# EAGLE design Power_Distro_PCB (EAGLE 8.3.2)
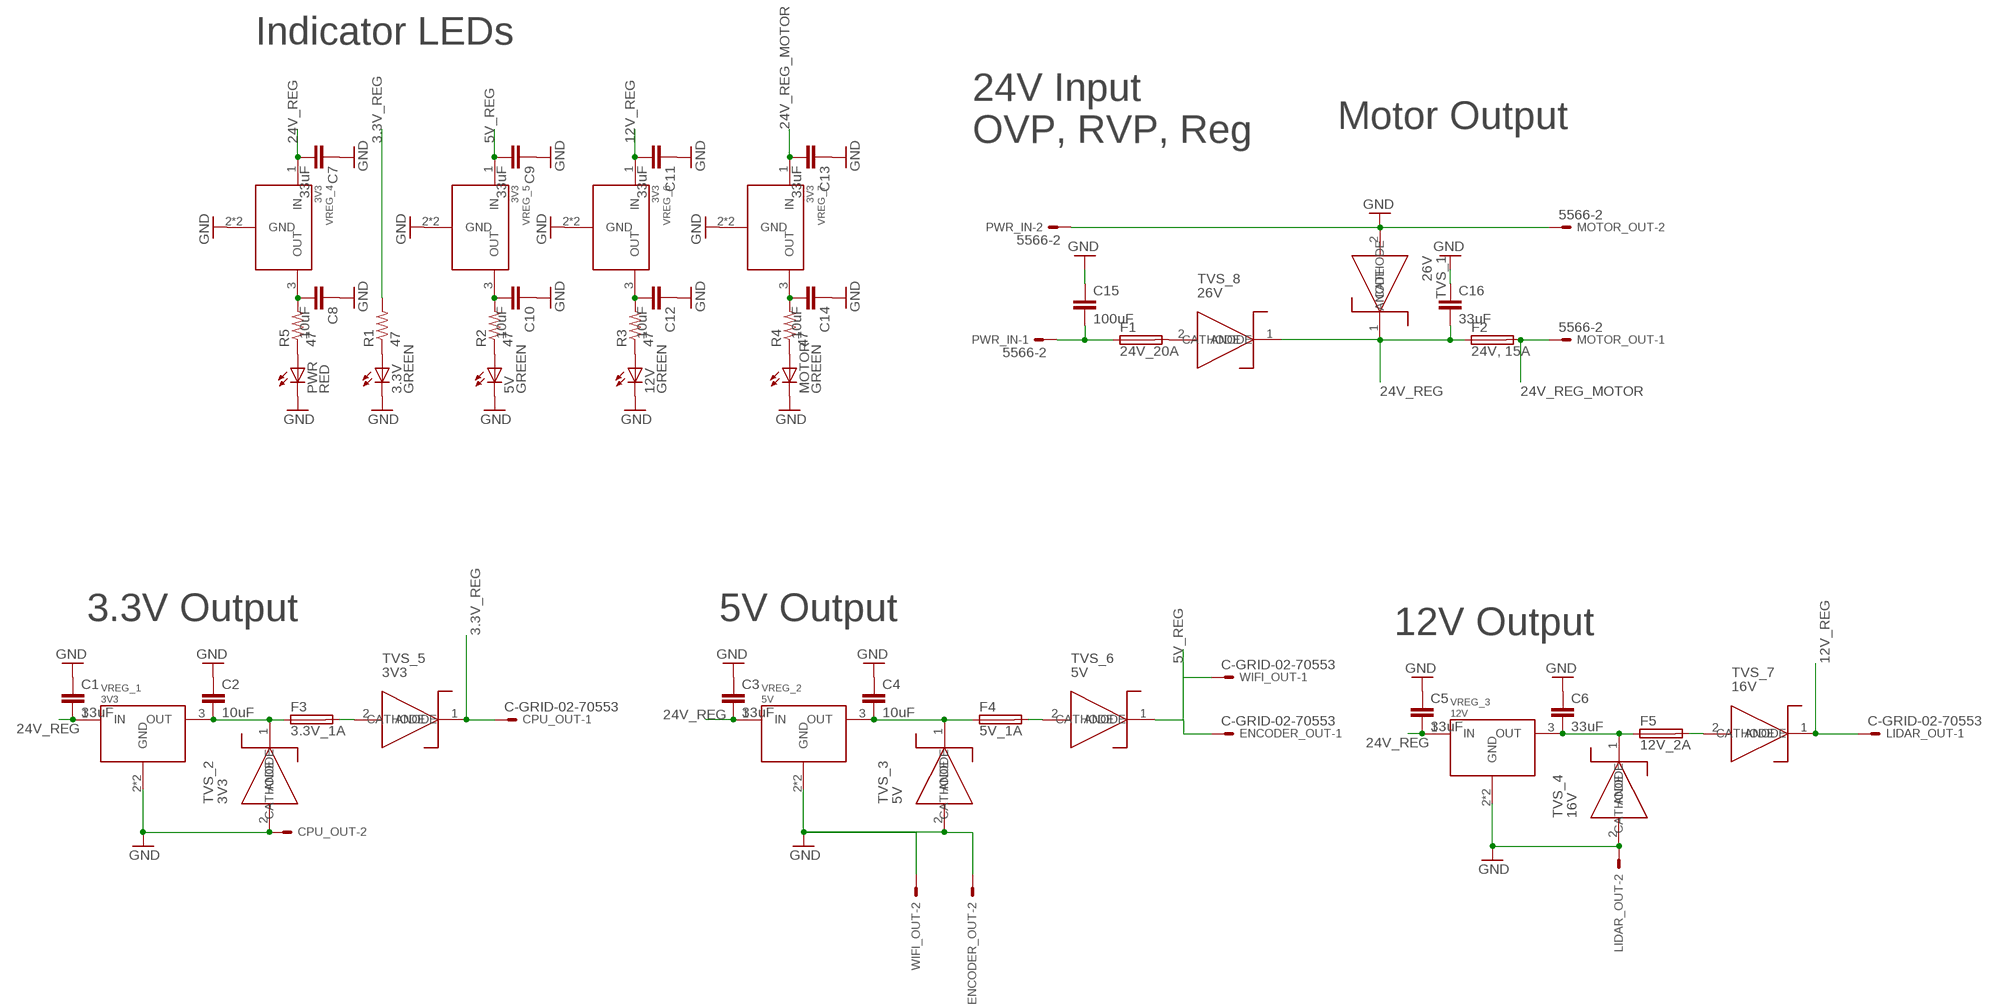
[diagram p0: schematic, sheet 1]

## Parts
3.3V  GREEN  LEDSML1206  [SML1206]
5V  GREEN  LEDSML1206  [SML1206]
12V  GREEN  LEDSML1206  [SML1206]
C1  33uF  C-EUC1206  [C1206]
C2  10uF  C-EUC1206  [C1206]
C3  33uF  C-EUC1206  [C1206]
C4  10uF  C-EUC1206  [C1206]
C5  33uF  C-EUC1206  [C1206]
C6  33uF  C-EUC1206  [C1206]
C7  33uF  C-EUC1206  [C1206]
C8  10uF  C-EUC1206  [C1206]
C9  33uF  C-EUC1206  [C1206]
C10  10uF  C-EUC1206  [C1206]
C11  33uF  C-EUC1206  [C1206]
C12  10uF  C-EUC1206  [C1206]
C13  33uF  C-EUC1206  [C1206]
C14  10uF  C-EUC1206  [C1206]
C15  100uF  C-EUC1206  [C1206]
C16  33uF  C-EUC1206  [C1206]
CPU_OUT  C-GRID-02-70553  [70553-02]
ENCODER_OUT  C-GRID-02-70553  [70553-02]
F1  24V_20A  TE5  [TE5]
F2  24V, 15A  TE5  [TE5]
F3  3.3V_1A  TE5  [TE5]
F4  5V_1A  TE5  [TE5]
F5  12V_2A  TE5  [TE5]
LIDAR_OUT  C-GRID-02-70553  [70553-02]
MOTOR  GREEN  LEDSML1206  [SML1206]
MOTOR_OUT  5566-2  [5566-2]
PWR  RED  LEDSML1206  [SML1206]
PWR_IN  5566-2  [5566-2]
R1  47  R-US_R1206  [R1206]
R2  47  R-US_R1206  [R1206]
R3  47  R-US_R1206  [R1206]
R4  47  R-US_R1206  [R1206]
R5  47  R-US_R1206  [R1206]
TVS_1  26V  SMAJ26A_TVSSMA  [DO-214AC]
TVS_2  3V3  SMBJ3V3_TVSSMB  [DO-214AA]
TVS_3  5V  SMAJ5.0_TVSSMA  [DO-214AC]
TVS_4  16V  PRSMA16_TVS  [DO-214AC]
TVS_5  3V3  SMBJ3V3_TVSSMB  [DO-214AA]
TVS_6  5V  SMAJ5.0_TVSSMA  [DO-214AC]
TVS_7  16V  PRSMA16_TVS  [DO-214AC]
TVS_8  26V  SMAJ26A_TVSSMA  [DO-214AC]
VREG_1  3V3  HIGH-CURRENT_REGSMA  [TO-263-3]
VREG_2  5V  HIGH-CURRENT_REGSMA  [TO-263-3]
VREG_3  12V  HIGH-CURRENT_REGSMA  [TO-263-3]
VREG_4  3V3  HIGH-CURRENT_REGSMA  [TO-263-3]
VREG_5  3V3  HIGH-CURRENT_REGSMA  [TO-263-3]
VREG_6  3V3  HIGH-CURRENT_REGSMA  [TO-263-3]
VREG_7  3V3  HIGH-CURRENT_REGSMA  [TO-263-3]
WIFI_OUT  C-GRID-02-70553  [70553-02]

## Nets
3.3V_REG: CPU_OUT.1 R1.2 TVS_5.1(CATHODE)
5V_REG: C9.2 ENCODER_OUT.1 TVS_6.1(CATHODE) VREG_5.1(IN) WIFI_OUT.1
12V_REG: C11.2 LIDAR_OUT.1 TVS_7.1(CATHODE) VREG_6.1(IN)
24V_REG: C1.2 C3.2 C5.2 C7.2 C16.2 F2.1 TVS_1.1(CATHODE) TVS_8.1(CATHODE) VREG_1.1(IN) VREG_2.1(IN) VREG_3.1(IN) VREG_4.1(IN)
24V_REG_MOTOR: C13.2 F2.2 MOTOR_OUT.1 VREG_7.1(IN)
GND: 3.3V.C 5V.C 12V.C C1.1 C2.1 C3.1 C4.1 C5.1 C6.1 C7.1 C8.1 C9.1 C10.1 C11.1 C12.1 C13.1 C14.1 C15.1 C16.1 CPU_OUT.2 ENCODER_OUT.2 LIDAR_OUT.2 MOTOR.C MOTOR_OUT.2 PWR.C PWR_IN.2 TVS_1.2(ANODE) TVS_2.2(ANODE) TVS_3.2(ANODE) TVS_4.2(ANODE) VREG_1.2(GND) VREG_1.4(GND) VREG_2.2(GND) VREG_2.4(GND) VREG_3.2(GND) VREG_3.4(GND) VREG_4.2(GND) VREG_4.4(GND) VREG_5.2(GND) VREG_5.4(GND) VREG_6.2(GND) VREG_6.4(GND) VREG_7.2(GND) VREG_7.4(GND) WIFI_OUT.2
N$1: F1.2 TVS_8.2(ANODE)
N$2: 3.3V.A R1.1
N$3: C15.2 F1.1 PWR_IN.1
N$4: F3.2 TVS_5.2(ANODE)
N$5: 5V.A R2.1
N$6: C2.2 F3.1 TVS_2.1(CATHODE) VREG_1.3(OUT)
N$7: C4.2 F4.1 TVS_3.1(CATHODE) VREG_2.3(OUT)
N$8: 12V.A R3.1
N$9: MOTOR.A R4.1
N$10: C6.2 F5.1 TVS_4.1(CATHODE) VREG_3.3(OUT)
N$11: F4.2 TVS_6.2(ANODE)
N$12: PWR.A R5.1
N$13: C8.2 R5.2 VREG_4.3(OUT)
N$14: C10.2 R2.2 VREG_5.3(OUT)
N$15: C12.2 R3.2 VREG_6.3(OUT)
N$16: C14.2 R4.2 VREG_7.3(OUT)
N$17: F5.2 TVS_7.2(ANODE)

## Notes on the sheet
- Indicator LEDs
- Motor Output
- 24V Input 
  OVP, RVP, Reg
- 3.3V Output | 5V Output
- 12V Output

## Library data of the parts
3.3V 5V 12V MOTOR PWR = led:LED: LED OSRAM: - CHIPLED LG R971, LG N971, LY N971, LG Q971, LY Q971, LO R971, LY R971 LH N974, LH R974 LS Q976, LO Q976, LY Q976 LO Q996 - Hyper CHIPLED LW Q18S LB Q993, LB Q99A, LB R99A - SideLED LS A670, LO A670, LY A670, LG A670, LP A670 LB A673, LV A673, LT A673, LW A673 LH A674 LY A675 LS A676, LA A676, LO A676, LY A676, LW A676 LS A679, LY A679, LG A679 - Hyper Micro SIDELED® LS Y876, LA Y876, LO Y876, LY Y876 LT Y87S - SmartLED LW L88C, LW L88S LB L89C, LB L89S, LG L890 LS L89K, LO L89K, LY L89K LS L896, LA L896, LO L896, LY L896 - TOPLED LS T670, LO T670, LY T670, LG T670, LP T670 LSG T670, LSP T670, LSY T670, LOP T670, LYG T670 LG T671, LOG T671, LSG T671 LB T673, LV T673, LT T673, LW T673 LH T674 LS T676, LA T676, LO T676, LY T676, LB T676, LH T676, LSB T676, LW T676 LB T67C, LV T67C, LT T67C, LS T67K, LO T67K, LY T67K, LW E67C LS E67B, LA E67B, LO E67B, LY E67B, LB E67C, LV E67C, LT E67C LW T67C LS T679, LY T679, LG T679 LS T770, LO T770, LY T770, LG T770, LP T770 LB T773, LV T773, LT T773, LW T773 LH T774 LS E675, LA E675, LY E675, LS T675 LS T776, LA T776, LO T776, LY T776, LB T776 LHGB T686 LT T68C, LB T68C - Hyper Mini TOPLED® LB M676 - Mini TOPLED Santana® LG M470 LS M47K, LO M47K, LY M47K Source: http://www.osram.convergy.de LUXEON: - LUMILED® LXK2-PW12-R00, LXK2-PW12-S00, LXK2-PW14-U00, LXK2-PW14-V00 LXK2-PM12-R00, LXK2-PM12-S00, LXK2-PM14-U00 LXK2-PE12-Q00, LXK2-PE12-R00, LXK2-PE12-S00, LXK2-PE14-T00, LXK2-PE14-U00 LXK2-PB12-K00, LXK2-PB12-L00, LXK2-PB12-M00, LXK2-PB14-N00, LXK2-PB14-P00, LXK2-PB14-Q00 LXK2-PR12-L00, LXK2-PR12-M00, LXK2-PR14-Q00, LXK2-PR14-R00 LXK2-PD12-Q00, LXK2-PD12-R00, LXK2-PD12-S00 LXK2-PH12-R00, LXK2-PH12-S00 LXK2-PL12-P00, LXK2-PL12-Q00, LXK2-PL12-R00 Source: www.luxeon.com KINGBRIGHT: KA-3528ASYC Source: www.kingbright.com
C1-C16 = resistor:C-EU: CAPACITOR, European symbol
CPU_OUT ENCODER_OUT LIDAR_OUT WIFI_OUT = con-molex:C-GRID-02: CONNECTOR wire to board 2.54 mm (0.100") pitch header; OC_FARNELL: unknown; OC_NEWARK: unknown
F1-F5 = fuse:TE5: FUSE Wickmann; OC_FARNELL: unknown; OC_NEWARK: unknown
MOTOR_OUT PWR_IN = con-molex:5566-2: Mini FIT connector 2 pol Source: http://www.molex.com; OC_FARNELL: 1822072; OC_NEWARK: unknown
R1-R5 = resistor:R-US_: RESISTOR, American symbol
TVS_1 TVS_8 = POWER_DISTRO:SMAJ26A_TVS: TVS Diode, SMAJ26A
TVS_2 TVS_5 = POWER_DISTRO:SMBJ3V3_TVS: SMBJ_3.3, TVS Diode
TVS_3 TVS_6 = POWER_DISTRO:SMAJ5.0_TVS: TVS Diode, SMAJ Series
TVS_4 TVS_7 = POWER_DISTRO:PRSMA16_TVS: TVS Diode, PRSMA16
VREG_1-VREG_7 = POWER_DISTRO:HIGH-CURRENT_REG: MIC29X, High Voltage Reg.

## Net classes
0 default: width 0.025 mm, drill 0.254 mm, clearance 0.254 mm
1 Power IN: width 4.801 mm
2 Motor_OUT: width 4.801 mm
3 3.3V_1A: width 0.305 mm
4 5V_1A: width 0.305 mm
5 12V_2A: width 0.813 mm

## Board
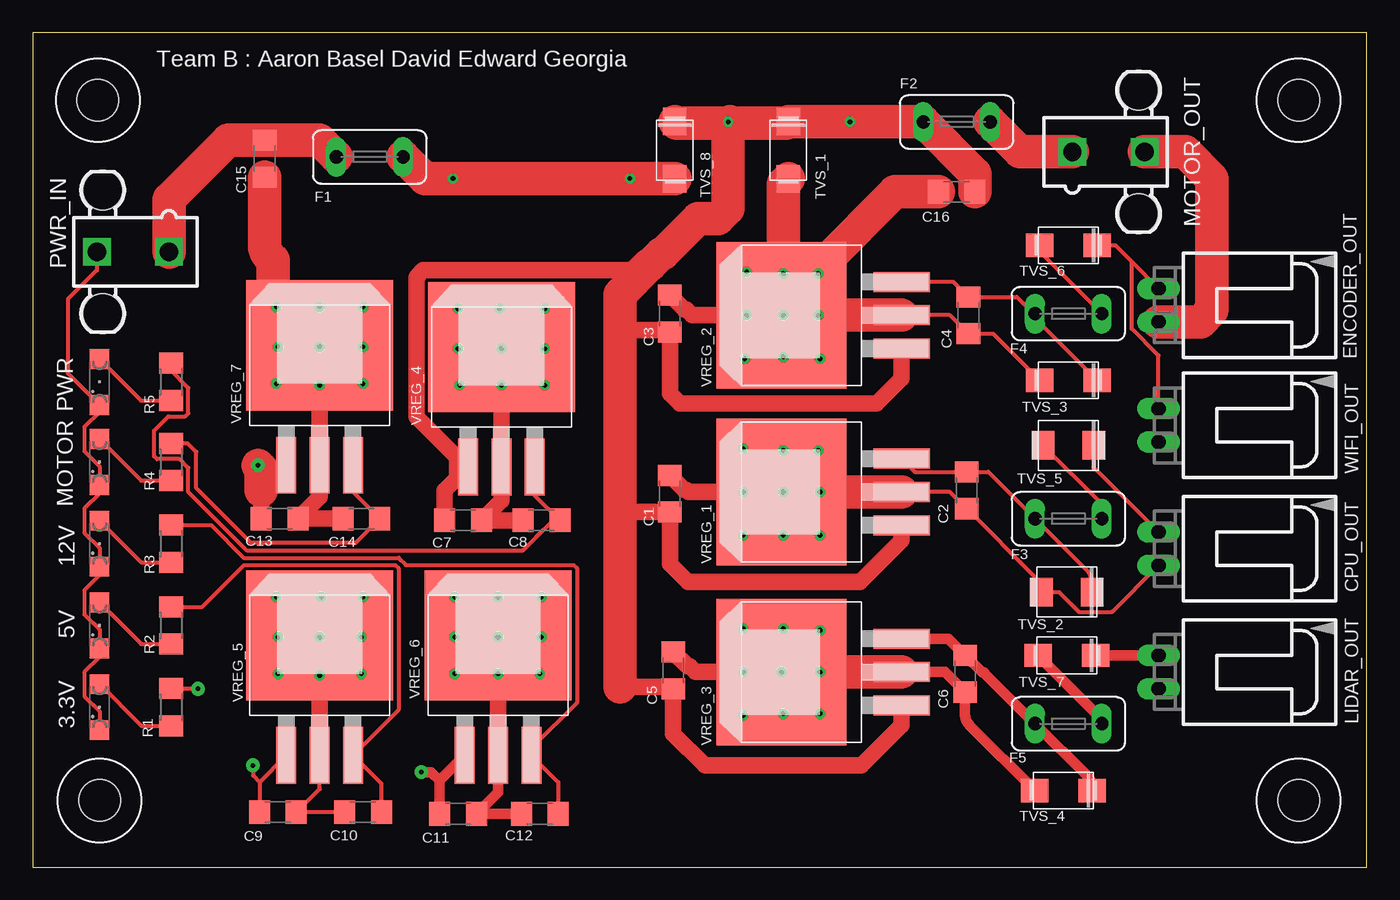
[diagram p1: board, top side]
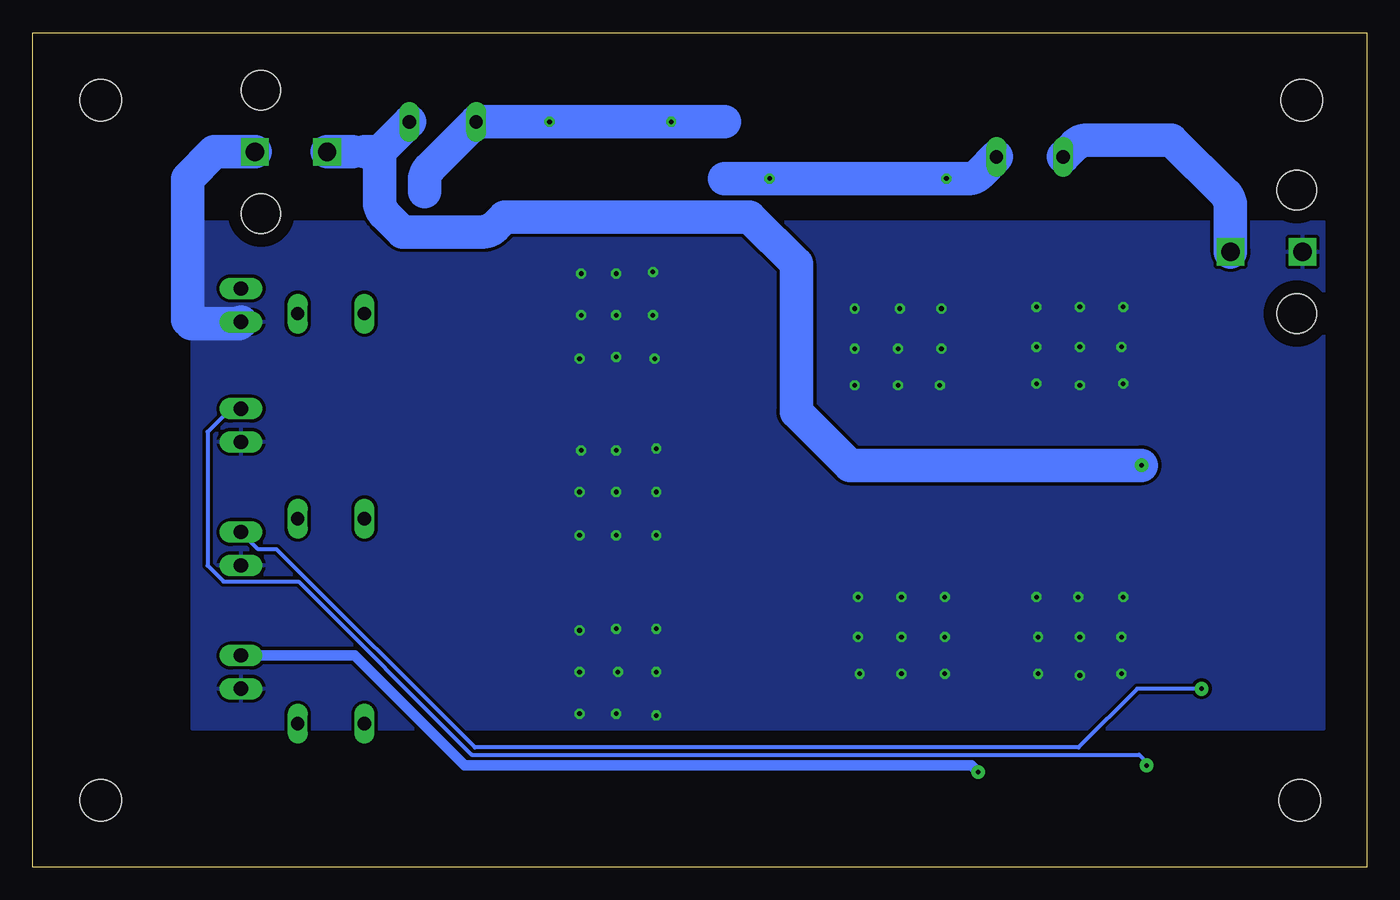
[diagram p2: board, bottom side, seen from below]

Size 101.58 x 63.55 mm. Coordinates in mm from the lower left corner, seen from the top.
Outline: 0,0 101.58,0 101.58,63.55 0,63.55 0,0
Copper layers (1*16): Top 0.035mm / dielectric 1.5mm / Bottom 0.035mm
Design rules "default *": minimum track width 6mil, minimum drill 0.35mm, track to track 6mil, track to pad 6mil, pad to pad 6mil, via to via 6mil, smd to smd 6mil, copper to edge 40mil, drill to drill 6mil, minimum pad ring 10mil, minimum via ring 8mil, stop-mask expansion 4mil, vias tented up to drill 0mil, thermal gap 10mil
Holes 3.17 mm at 5.08,5.08 96.39,5.08 4.95,58.42 96.39,58.42

### Footprints (pad centres in the part's own frame; a part is rotated, then mirrored left to right if it is on the bottom)
SML1206 = smd 1.5 x 1.5: A 1.75,0; C -1.75,0
C1206 = smd 1.6 x 1.8: 1 -1.4,0; 2 1.4,0
70553-02 = drill 1.092 long: 1 -1.27,-7.62; 2 1.27,-7.62
TE5 = drill 1.016 long: 1 -2.54,0; 2 2.54,0
5566-2 = drill 1.4 square: 1 0,-2.75; 2 0,2.75 | hole 3: 4.7,2.29; -4.7,2.29
R1206 = smd 1.6 x 1.803: 1 -1.422,0; 2 1.422,0
DO-214AC = smd 2.083 x 1.778: 1 -2.184,0; 2 2.184,0
DO-214AA = smd 1.702 x 2.184: 1 -1.93,0 | smd 1.714 x 2.184: 2 1.93,0
TO-263-3 = smd 1.524 x 4.318: 1 -2.54,-7.62; 2 0,-7.62; 3 2.54,-7.62 | smd 11.176 x 9.906: 4 0,1.524

### Placement (x,y rotation side)
3.3V  5.08,12.19 90 top
5V  5.08,18.41 90 top
12V  5.08,24.64 90 top
C1  48.51,28.45 270 top
C2  71.12,28.7 90 top
C3  48.51,42.16 270 top
C4  71.25,42.04 90 top
C5  48.77,14.99 270 top
C6  70.99,14.73 90 top
C7  32.77,26.42 180 top
C8  38.73,26.42 0 top
C9  18.67,4.19 180 top
C10  25.15,4.19 0 top
C11  32.38,4.06 180 top
C12  38.61,4.06 0 top
C13  18.8,26.54 180 top
C14  25.02,26.54 0 top
C15  17.65,53.98 90 top
C16  70.36,51.44 0 top
CPU_OUT  93.34,24.26 270 top
ENCODER_OUT  93.34,42.8 270 top
F1  25.65,54.1 0 top
F2  70.36,56.77 0 top
F3  78.87,26.54 0 top
F4  78.87,42.16 0 top
F5  78.87,10.92 0 top
LIDAR_OUT  93.34,14.86 270 top
MOTOR  5.08,30.86 90 top
MOTOR_OUT  81.92,54.48 270 top
PWR  5.08,36.96 90 top
PWR_IN  7.62,46.86 90 top
R1  10.54,12.19 90 top
R2  10.54,18.41 90 top
R3  10.54,24.64 90 top
R4  10.54,30.86 90 top
R5  10.54,36.96 90 top
TVS_1  57.53,54.61 270 top
TVS_2  78.74,20.95 180 top
TVS_3  78.87,37.08 180 top
TVS_4  78.49,5.84 180 top
TVS_5  78.87,32.13 180 top
TVS_6  78.87,47.37 180 top
TVS_7  78.74,16.13 180 top
TVS_8  48.9,54.61 270 top
VREG_1  58.55,28.57 90 top
VREG_2  58.55,42.04 90 top
VREG_3  58.55,14.86 90 top
VREG_4  35.69,38.1 0 top
VREG_5  21.84,16.13 0 top
VREG_6  35.43,16.13 0 top
VREG_7  21.84,38.23 0 top
WIFI_OUT  93.34,33.66 270 top

### Tracks (layer width: path | path; a pad name or v marks a point on that pad's centre or on a via)
3.3V_REG  (via drill 0.35 pad 1.05)
  Top 0.305: 85.34,25.53 CPU_OUT.1 80.8,30.45 TVS_5.1 | R1.2 12.55,13.61 v12.57,13.59
  Bottom 0.305: v12.57,13.59 17.48,13.59 21.95,9.12 67.92,9.12 83.01,24.21 84.41,24.21 CPU_OUT.1
5V_REG  (via drill 0.35 pad 1.05)
  Top 0.305: 17.27,6.47 C9.2 | 17.27,6.47 VREG_5.1 | v16.76,7.75 16.76,6.98 17.27,6.47 | TVS_6.1 82.42,47.37 83.68,46.11 | 83.68,46.11 ENCODER_OUT.1 | 83.68,46.11 83.68,41.02 85.72,38.98 WIFI_OUT.1
  Bottom 0.305: WIFI_OUT.1 86.49,34.92 88.27,33.15 88.27,22.98 87.05,21.76 81.35,21.76 68.15,8.56 17.32,8.56 16.76,8 v16.76,7.75
12V_REG  (via drill 0.35 pad 1.05)
  Top 0.813: 30.98,6.6 C11.2 | 30.98,6.6 VREG_6.1 | v29.59,7.24 30.35,7.24 30.98,6.6 | TVS_7.1 LIDAR_OUT.1
  Bottom 0.813: 85.2,16.13 LIDAR_OUT.1 77.09,16.13 68.71,7.75 30.1,7.75 v29.59,7.24
24V_REG  (via drill 0.35)
  Top 1.27: VREG_1.1 66.17,24.89 62.99,21.72 49.91,21.72 48.51,23.11 C1.2 44.7,27.05 44.62,27.05 | VREG_3.1 66.17,10.79 63.12,7.75 51.18,7.75 48.77,10.16 C5.2 48.64,13.72 44.7,13.72 | VREG_2.1 66.17,37.21 64.26,35.31 49.28,35.31 48.51,36.07 C3.2 48.38,40.89 44.7,40.89 | C7.2 31.37,28.7 32.32,29.65 | 32.32,29.65 VREG_4.1 | 47.03,45.89 46.61,45.47 29.73,45.47 29.21,44.95 29.21,34.3 32.32,31.19 32.32,29.65
  Top 2.54: 52.96,56.67 53.09,56.79 | 52.96,56.67 52.96,50.16 52.2,49.4 50.67,49.4 48.01,46.74 47.88,46.74 47.03,45.89 46.98,45.89 44.7,43.61 44.7,40.89 44.7,27.05 44.7,13.72 | C16.2 71.76,52.83 F2.1 65.25,56.79 TVS_1.1 57.4,56.67 52.96,56.67 | TVS_8.1 49.02,56.67 52.96,56.67
  Bottom 2.54: 57.53,56.77 v62.23,56.77 F2.1 71.38,53.2 arc-45 71.75,52.31 C16.2 | 57.53,56.77 57.4,56.77 57.53,56.77 | 57.53,56.77 v52.96,56.77 48.9,56.77
24V_REG_MOTOR  (via drill 0.35 pad 1.05)
  Top 1.27: C13.2 17.4,28.7 VREG_7.1
  Top 2.54: F2.2 75.18,54.48 MOTOR_OUT.1 | 17.4,28.7 17.4,30.36 v17.14,30.61
  Bottom 2.54: 76.33,54.48 75.18,54.48 | MOTOR_OUT.1 77.22,54.48 | v17.14,30.61 39.37,30.61 43.43,34.67 43.43,45.97 46.99,49.53 65.66,49.53 66.43,48.76 arc45 67.33,48.39 73.41,48.39 74.81,49.79 arc45 75.18,50.69 75.18,54.48 | 75.18,54.48 F2.2
GND  (via drill 0.35)
  Top 0.152: VREG_2.4 arc-45 57.29,42.69 v59.82,45.21 | VREG_2.4 57.02,42.27 arc-45 57.4,43.17 60.2,45.97 | VREG_2.4 57.02,44.91 arc-45 v57.15,45.21 | VREG_2.4 57.02,45.03 arc-45 57.15,45.34 | VREG_2.4 53.72,42.04 | 53.85,28.57 VREG_1.4 v57.15,28.57 | v35.43,17.53 VREG_6.4 35.43,14.22 | v21.84,17.53 VREG_5.4 21.84,14.35 | VREG_3.4 53.72,14.86 | VREG_7.4 arc-45 20.98,40.11 18.29,42.8
  Top 0.305: VREG_2.2 69.85,42.04 C4.1 73.13,40.64 TVS_3.2 | VREG_1.2 69.85,28.57 C2.1 76.44,21.98 arc-45 76.81,21.09 TVS_2.2 78.15,20.95 79.65,19.46 82.19,19.46 CPU_OUT.2 | VREG_5.2 21.84,5.97 C9.1 C10.1 | 3.3V.C 5.08,11.87 3.92,13.02 3.92,14.86 5.08,16.02 5V.C 5.08,18.09 3.92,19.25 3.92,21.08 5.08,22.24 12V.C 5.08,24.31 3.92,25.47 3.92,27.31 5.08,28.46 MOTOR.C 5.08,30.54 3.92,31.69 3.92,33.53 5.08,34.69 PWR.C 2.66,37.62 2.66,43.27 4.87,45.48 PWR_IN.2 | v57.15,28.57 59.56,28.57 | 57.15,45.34 57.02,45.21
  Top 0.813: VREG_3.2 69.47,14.86 C6.1 70.99,11.68 arc45 71.36,10.78 TVS_4.2 | VREG_6.2 35.43,5.71 C11.1 C12.1 | 35.69,14.22 35.43,14.22 | 21.97,39.88 VREG_7.4
  Top 1.27: C3.1 49.62,42.45 49.78,42.45 50.2,42.04 53.72,42.04 | C1.1 49.62,28.74 49.78,28.74 49.94,28.57 53.85,28.57 | C5.1 49.88,15.28 50.04,15.28 50.45,14.86 53.72,14.86 | C14.1 C13.1 21.84,28.19 VREG_7.2 v21.84,36.7 v21.84,39.62 VREG_7.4 | C8.1 C7.1 35.69,27.94 VREG_4.2 v35.69,36.7 v35.69,39.5 VREG_4.4 | 21.84,14.35 VREG_5.2 | 35.43,14.22 VREG_6.2
  Top 2.54: VREG_3.2 VREG_3.4 | 59.56,28.57 VREG_1.2 | VREG_2.2 VREG_2.4 | MOTOR_OUT.2 87.76,54.48 89.79,52.45 89.79,42.42 88.9,41.53 ENCODER_OUT.2 | TVS_1.2 57.15,52.05 57.15,45.34 | C16.1 65.66,51.44 60.2,45.97 | 18.29,42.8 18.29,46.23 18.02,46.49 arc-45 17.65,47.39 C15.1
  Bottom 2.54: MOTOR_OUT.2 87.76,54.48 89.79,52.45 89.79,41.66 89.53,41.4 85.85,41.4 ENCODER_OUT.2
  other vias: 18.54,42.67 18.67,39.62 18.54,36.83 21.84,42.67 25.15,42.67 25.15,39.62 25.15,36.83 32.38,42.55 32.38,39.5 32.51,36.7 35.56,42.55 38.99,42.55 38.99,39.5 38.99,36.7 25.02,17.53 25.15,20.57 21.97,20.57 18.54,20.57 18.67,17.53 18.67,14.73 21.84,14.61 25.02,14.73 32.13,17.53 32.13,14.73 35.43,14.73 38.61,14.73 38.73,17.53 38.73,20.57 35.43,20.57 32.13,20.57 57.02,14.86 57.15,18.16 57.15,11.68 59.94,11.68 59.94,14.86 59.94,18.03 54.1,18.16 54.1,14.86 54.1,11.56 57.15,25.27 59.94,25.27 59.94,28.57 54.1,25.27 54.1,28.57 54.1,31.88 57.15,31.75 59.82,31.75 57.15,42.04 57.15,38.86 59.82,42.04 59.94,38.73 54.23,38.73 54.36,42.04 54.36,45.34
  pour Bottom: 3.3,49.15 3.3,10.54 89.41,10.54 89.41,49.15
N$1  (via drill 0.35)
  Top 2.54: F1.2 29.87,52.43 TVS_8.2
  Bottom 2.54: F1.2 29.47,52.82 arc45 30.37,52.45 v32,52.45 v45.47,52.45 48.9,52.45
N$2
  Top 0.305: 3.3V.A 8.25,10.77 R1.1
N$3
  Top 2.54: F1.1 21.84,55.38 C15.2 14.86,55.37 10.37,50.88 PWR_IN.1
  Bottom 2.54: PWR_IN.1 10.37,50.36 arc-45 10.74,51.26 14.86,55.37 21.32,55.37 arc-45 22.22,55 F1.1
N$4
  Top 0.305: F3.2 81.41,27.66 TVS_5.2
N$5
  Top 0.305: 5V.A 8.25,16.99 R2.1
N$6
  Top 0.305: VREG_1.3 67.18,30.1 C2.2 72.77,30.1 76.45,26.42 | TVS_2.1 80.67,21.67 arc45 80.3,22.57 76.45,26.42 | 76.45,26.42 F3.1
N$7
  Top 0.305: VREG_2.3 70.11,44.58 C4.2 74.93,43.44 76.33,42.04 | 76.33,42.04 F4.1 | 76.33,42.04 76.33,41.81 TVS_3.1
N$8
  Top 0.305: 12V.A 8.25,23.22 R3.1
N$9
  Top 0.305: MOTOR.A 8.25,29.44 R4.1
N$10
  Top 0.813: VREG_3.3 69.73,17.4 C6.2 72.27,14.86 arc-45 72.48,14.77 F5.1 80.3,6.95 arc-45 80.67,6.05 TVS_4.1
N$11
  Top 0.305: TVS_6.2 76.68,46.89 F4.2
N$12
  Top 0.305: PWR.A 8.25,35.53 R5.1
N$13
  Top 0.305: C8.2 38.23,28.32 VREG_4.3 | C8.2 39.61,26.42 | 39.61,26.42 38.3,25.11 | R5.2 10.54,37.81 11.85,36.5 11.85,34.57 11.61,34.33 10.31,34.33 9.23,33.25 9.23,31.32 9.47,31.08 11.18,31.08 11.85,30.41 11.85,28.57 16.28,24.13 37.32,24.13 39.61,26.42 | 39.61,26.42 C8.2
N$14
  Top 0.305: C10.2 26.55,6.35 VREG_5.3 27.84,11.96 27.84,22.77 27.6,23.01 16.09,23.01 12.91,19.84 R2.2
N$15
  Top 0.305: 38.04,8.45 VREG_6.3 | 38.04,8.45 40.01,6.47 C12.2 | R3.2 13.56,26.06 16.05,23.57 27.86,23.57 28.42,23.01 41.19,23.01 41.43,22.77 41.43,12.53 38.04,9.14 38.04,8.45
N$16
  Top 0.305: VREG_7.3 24.38,28.58 C14.2 24.57,24.69 16.64,24.69 12.45,28.88 12.45,31.62 11.79,32.28 R4.2
N$17
  Top 0.813: F5.2 arc45 81.16,11.53 TVS_7.2

### Text on the board
tNames: Team B : Aaron Basel David Edward Georgia